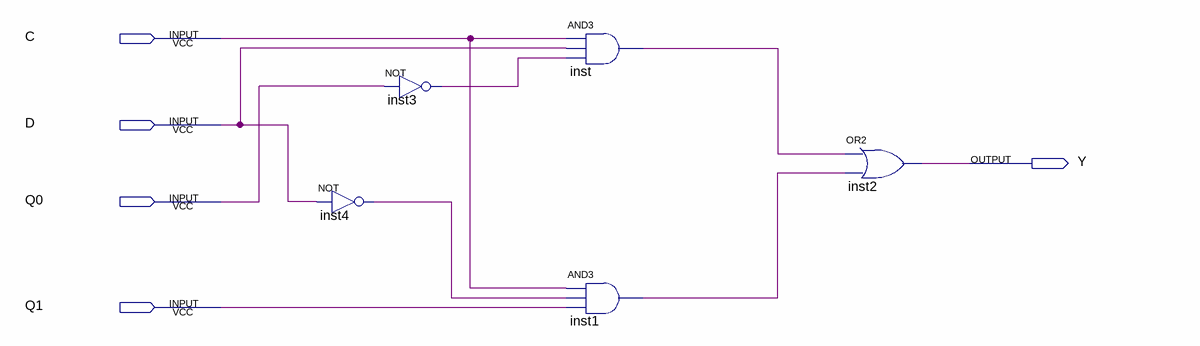
[diagram p0: schematic sheet]
// Quartus schematic OUTPUT.bdf as structural Verilog: 5 symbols, 5 pins
module OUTPUT (
  input  C,
  input  D,
  input  Q0,
  input  Q1,
  output Y
);

  wire inst1_out, inst3_out, inst4_out, inst_out;

  not inst4 (inst4_out, D);
  not inst3 (inst3_out, Q0);
  and inst (inst_out, C, D, inst3_out);
  and inst1 (inst1_out, C, inst4_out, Q1);
  or inst2 (Y, inst_out, inst1_out);
endmodule
